# Altium schematic sheet Practica.SchDoc
size A4; SheetNumber: 1; SheetTotal: 1
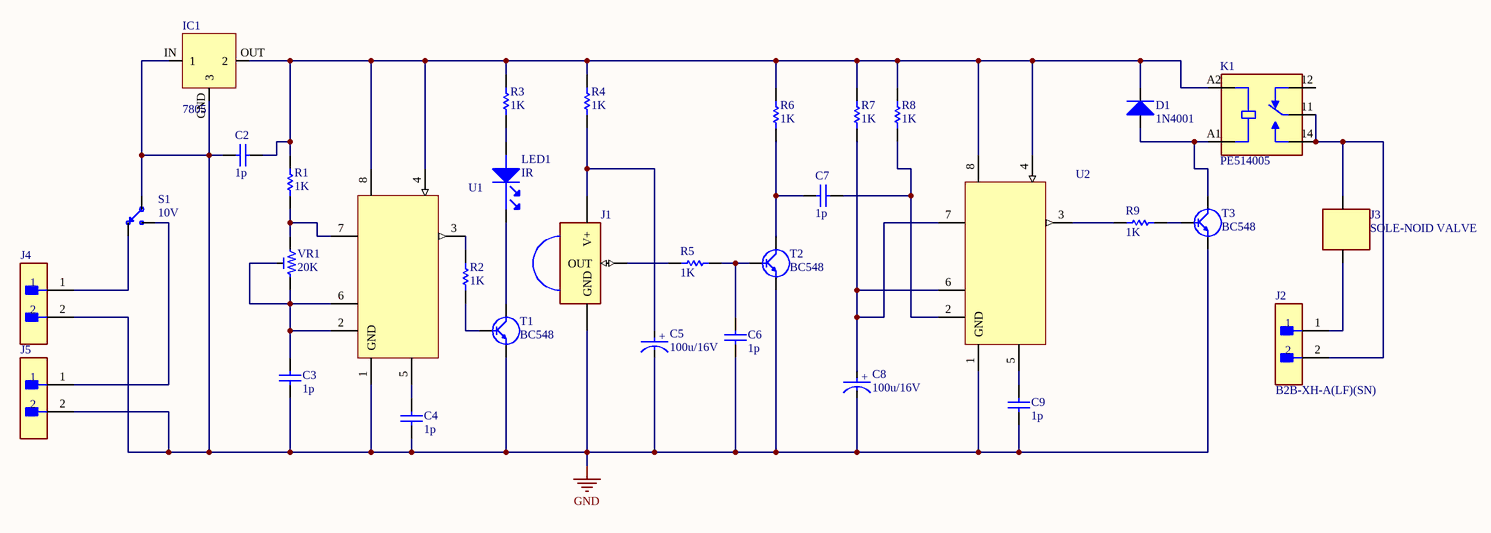
[diagram p0: Practica.SchDoc]

## Parts
C2  value 1p  [CAPC1005X55N]  (hidden comment: Capacitor)
C3  value 1p  [CAPC1005X55N]  (hidden comment: Capacitor)
C4  value 1p  [CAPC1005X55N]  (hidden comment: Capacitor)
C5  100u/16V  [WCAP-ASLI_D4H5.5]
C6  value 1p  [CAPC1005X55N]  (hidden comment: Capacitor)
C7  value 1p  [CAPC1005X55N]  (hidden comment: Capacitor)
C8  100u/16V  [WCAP-ASLI_D4H5.5]
C9  value 1p  [CAPC1005X55N]  (hidden comment: Capacitor)
D1  1N4001  [DIOAD1036W78L470D235]
IC1  7805  [78XXS]
J1  TSOP1738  [TSOP17XX]  (value not drawn)
J2  B2B-XH-A(LF)(SN)  [FP-B2B-XH-A_LF_SN-MFG]
J3  SOLE-NOID VALVE  [PHOENIX_1904147]
J4  B2B-XH-A(LF)(SN)  [FP-B2B-XH-A_LF_SN-MFG]  (value not drawn)
J5  B2B-XH-A(LF)(SN)  [FP-B2B-XH-A_LF_SN-MFG]  (value not drawn)
K1  PE514005  [RELAY_PE514005]
LED1  IR  [LED3MM]
R1  value 1K  [RESC1005X40N]  (hidden comment: Resistor)
R2  value 1K  [RESC1005X40N]  (hidden comment: Resistor)
R3  value 1K  [RESC1005X40N]  (hidden comment: Resistor)
R4  value 1K  [RESC1005X40N]  (hidden comment: Resistor)
R5  value 1K  [RESC1005X40N]  (hidden comment: Resistor)
R6  value 1K  [RESC1005X40N]  (hidden comment: Resistor)
R7  value 1K  [RESC1005X40N]  (hidden comment: Resistor)
R8  value 1K  [RESC1005X40N]  (hidden comment: Resistor)
R9  value 1K  [RESC1005X40N]  (hidden comment: Resistor)
S1  10V  [SW_A101SYZQ04]
T1  BC548  [TO92250P510H770-3]
T2  BC548  [TO92250P510H770-3]
T3  BC548  [TO92250P510H770-3]
U1  LMC555CMM/NOPB  [DGK0008A_L]  (value not drawn)
U2  LMC555CMM/NOPB  [DGK0008A_L]  (value not drawn)
VR1  20K  [TRIM_PV36W203C01B00]

## Nets
GND: C2.1 C3.1 C4.1 C5.1(C) C6.1 C8.1(C) C9.1 IC1.GND(3) IC1.IN(1) J1.GND J4.2 J5.2 S1.3 T1.3 T2.3 T3.3 U1.1(GND) U2.1(GND)
NetC2_2: C2.2 D1.C IC1.OUT(2) K1.A2(COIL1) R1.2 R3.2 R4.2 R6.2 R7.2 R8.2 U1.4(~{RST}) U1.8(V+) U2.4(~{RST}) U2.8(V+)
NetC3_2: C3.2 U1.2(~{TRIG}) U1.6(THR) VR1.2 VR1.3
NetC4_2: C4.2 U1.5(CVOLT)
NetC5_2: C5.2(A) J1.V+ R4.1
NetC6_2: C6.2 R5.1 T2.1
NetC7_1: C7.1 R6.1 T2.2
NetC7_2: C7.2 R8.1 U2.2(~{TRIG})
NetC8_2: C8.2(A) R7.1 U2.6(THR) U2.7(DIS)
NetC9_2: C9.2 U2.5(CVOLT)
NetD1_A: D1.A K1.A1(COIL2) T3.2
NetJ1_OUT: J1.OUT R5.2
NetJ2_1: J2.1 J3.2
NetJ2_2: J2.2 J3.1 K1.11(COM) K1.14(NO)
NetJ4_1: J4.1 S1.2
NetJ5_1: J5.1 S1.1
NetLED1_A: LED1.A R3.1
NetLED1_K: LED1.K T1.2
NetR1_1: R1.1 U1.7(DIS) VR1.1
NetR2_1: R2.1 T1.1
NetR2_2: R2.2 U1.3(OUT)
NetR9_1: R9.1 U2.3(OUT)
NetR9_2: R9.2 T3.1

Not connected (* = marked no-connect by the designer): K1 12(NC)

## Notes on the sheet
- (in symbol a00bbbee19879c290e62620ae7e47b1) +

## Library data of the parts
C2-C4 C6 C7 C9 = Capacitor: SimulationGenericComponent: True
C5 C8 = a00bbbee19879c290e62620ae7e47b1: 15uF 6.3V  ±20% 3.5Ω 1206  SMD Tantalum Capacitor; Manufacturer: Wurth Electronics; Manufacturer Part Number: 865080340001; ESR (Equivalent Series Resistance): 4R; Leakage Current: 900nA; Polarity: Polar; Dissipation Factor: 8%; Capacitor Type: Aluminium; Min Operating Temperature: -55°C; Weight: 0.000571oz; RoHS Compliant: Yes; Features: General Purpose; Length: 3.2mm; Max Operating Temperature: 125°C; Voltage Rating (DC): 6.3V; Width: 0.063inch; Lead Free: Lead Free; Termination: SMD/SMT; Height: 1.2mm; Depth: 1.6mm; Case/Package: 1206; Number of Pins: 2; Capacitance: 15uF; Case Code (Imperial): 1206; Series: TAJ; Tolerance: 20%; Voltage Rating: 6.3V; Dielectric Material: Tantalum; Construction: Flat; Case Code (Metric): 3216; Height - Seated (Max): 0.047inch; Packaging: Tape and Reel; Radiation Hardening: No; Mount: Surface Mount; Package Quantity: 2500; Supplier: Digikey; Supplier Part Number: 732-8411-1-ND; RoHS: Yes; Category: Aluminum Electrolytic Capacitors; Stock: 3909; Pricing: 1=0,18, 50=0,156, 100=0,135, 250=0,121, 500=0,105, 1000=0,1 (USD); Pins: 2; Reach SVHC Compliant: Yes; ComponentLink1URL: https://datasheet.ciiva.com:443/pdfs/VipMasterIC/IC/MIDC/MIDC-S-A0000770067/MIDC-S-A0000769932-1.pdf?src-supplier=IHS+Markit; ComponentLink1Description: https://datasheet.ciiva.com:443/pdfs/VipMasterIC/IC/MIDC/MIDC-S-A0000770067/MIDC-S-A0000769932-1.pdf?src-supplier=IHS+Markit; ComponentLink2URL: http://www.farnell.com/datasheets/1880118.pdf?src-supplier=Farnell; ComponentLink2Description: http://www.farnell.com/datasheets/1880118.pdf?src-supplier=Farnell; ComponentLink3URL: https://katalog.we-online.de/pbs/datasheet/865080340001.pdf?src-supplier=Digikey; ComponentLink3Description: https://katalog.we-online.de/pbs/datasheet/865080340001.pdf?src-supplier=Digikey; ComponentLink4URL: http://www.farnell.com/datasheets/1880118.pdf?src-supplier=Element14; ComponentLink4Description: http://www.farnell.com/datasheets/1880118.pdf?src-supplier=Element14; ComponentLink5URL: http://www.farnell.com/datasheets/1880118.pdf?src-supplier=Newark; ComponentLink5Description: http://www.farnell.com/datasheets/1880118.pdf?src-supplier=Newark
D1 = 1N4001: Manufacturer: Good-Ark; Supplier: DigiKey; Supplier Part Number: 4786-1N4001CT-ND; Manufacturer Part Number: 1N4001; RoHS: No; Stock: 12684; Pricing: 1=0,15, 10=0,09, 100=0,0557, 500=0,0403, 1000=0,03531, 2000=0,03109 (USD)
IC1 = IC1: Fixed Positive Standard Regulator, 5VBIPolar, PSSO2; Manufacturer: onsemi; Manufacturer Part Number: MC7805BDTG; Package Body Material: Plastic; Dropout Voltage1-Nom: 2V; Input Voltage Absolute-Max: 35V; Max Supply Voltage: 20V; Min Input Voltage: 7.5V; Channels: 1; Output Current1-Max: 1A; Output Voltage1-Max: 5.25V; Output Voltage1-Min: 4.75V; Output Voltage1-Nom: 5V; Package Equivalence Code: SMSIP3H,.38,90TB; Regulator Type: FIXED POSITIVE SINGLE OUTPUT STANDARD REGULATOR; Time @ Peak Reflow Temperature-Max (s): 40s; Voltage Tolerance-Max: 5%; Qualification Status: Not Qualified; Supplier: Future Electronics; Supplier Part Number: 9503160; RoHS: Yes; Category: Voltage Regulators - Linear; Stock: 3900; Pricing: 75=0,115, 750=0,111, 2250=0,109, 9375=0,106, 22500=0,103 (USD); Case/Package: TO-252; Pins: 2; Package Shape: Rectangular; Terminal Finish: Tin; JESD-609 Code: e3; Adjustability: FIXED; JESD-30 Code: R-PSSO-G2; Moisture Sensitivity Level: 1; Number of Outputs: 1; Operating Temperature, TJ-Max: 125°C; Operating Temperature, TJ-Min: -40°C; Packaging: Rail/Tube; Peak Reflow Temperature (Cel): 260°C; Surface Mount: Yes; Technology: BIPOLAR; Terminal Form: Gull Wing; Terminal Position: SINGLE; Length: 6.54mm; Width: 6.095mm; Height - Seated (Max): 2.51mm; Terminal Pitch: 2.29mm; RoHS Compliant: Yes; Reach SVHC Compliant: No; ComponentLink1URL: https://datasheet.ciiva.com:443/pdfs/VipMasterIC/IC/ONSM/ONSM-S-A0009067490/ONSM-S-A0009067422-1.pdf?src-supplier=IHS+Markit; ComponentLink1Description: https://datasheet.ciiva.com:443/pdfs/VipMasterIC/IC/ONSM/ONSM-S-A0009067490/ONSM-S-A0009067422-1.pdf?src-supplier=IHS+Markit; ComponentLink2URL: https://datasheet.ciiva.com/1512/1726421-1512154.pdf?src-supplier=Element14; ComponentLink2Description: https://datasheet.ciiva.com/1512/1726421-1512154.pdf?src-supplier=Element14; ComponentLink3URL: https://datasheet.ciiva.com/18428/70100553-18428182.pdf?src-supplier=Allied+Electronics; ComponentLink3Description: https://datasheet.ciiva.com/18428/70100553-18428182.pdf?src-supplier=Allied+Electronics
J1 = TSOP1738: IR Remote Receiver 38KHz 35m 3-Pin; MP: TSOP1738.; MF: Vishay; Check_prices: https://www.snapeda.com/parts/TSOP1738./Vishay/view-part/?ref=eda; Value: *; Availability: Not in stock; Price: None; Package: DIP-3 Vishay; SnapEDA_Link: https://www.snapeda.com/parts/TSOP1738./Vishay/view-part/?ref=snap
J2 J4 J5 = CON2: CONN HEADER VERT 2POS 2.5MM; Current Rating: 3A; Voltage Rating: 250V; Number of Contacts: 2; Contact Resistance: 20mR; Wire/Cable Gauge: 22AWG; Insulation Resistance: 1GR; Connector Type: Male Pin; Packaging: Bulk; Contact Material: Brass; Lead Free: Lead Free; Orientation: Straight; Contact Plating: Tin; Max Current Rating: 3A; Termination: Solder; Fastening Type: Detent; Depth: 5.75mm; Housing Material: Polyamide; REACH SVHC: No SVHC; Series: XH; Voltage Rating (AC): 250V; Number of Positions: 2; Color: Natural; Contact Type: Male Pin; Max Voltage Rating (DC): 250V; Pitch: 2.5mm; Lead Pitch: 2.5mm; Mount: Through Hole; Max Operating Temperature: 85°C; Length: 7.4mm; Max Voltage Rating (AC): 250V; Min Operating Temperature: -25°C; Number of Rows: 1; Housing Color: White
J3 = SOLE-NOID VALVE: PCB Terminal Screw 9.52mm 10AWG 1000V 32A 2 Position Combicon Power Series | Phoenix Contact 1904147; SnapEDA_Link: https://www.snapeda.com/parts/1904147/Phoenix+Contact/view-part/?ref=snap; Package: None; Value: *; MF: Phoenix Contact; MP: 1904147; Check_prices: https://www.snapeda.com/parts/1904147/Phoenix+Contact/view-part/?ref=eda
K1 = PE514005: Shrack, Relay,miniature,PCB,SPDT,5A,5Vdc coil, 1-1393219-7 | TE Connectivity PE514005; SnapEDA_Link: https://www.snapeda.com/parts/PE514005/TE+Connectivity/view-part/?ref=snap; Package: None; Value: *; MF: TE Connectivity; MP: PE514005; Check_prices: https://www.snapeda.com/parts/PE514005/TE+Connectivity/view-part/?ref=eda
LED1 = LED: LED SM 0603 3V -/1000/-MCD GREEN; Manufacturer: Visual Communications; Manufacturer Part Number: LSM0603453V; Optoelectronic Device Type: SINGLE COLOR LED; Supplier: Digikey; Supplier Part Number: LSM0603453VCT-ND; RoHS: Yes; Category: LEDs; Stock: 23373; Pricing: 1=0,5, 10=0,291, 100=0,1218, 500=0,1086, 1000=0,1071 (USD); Reach SVHC Compliant: Yes; RoHS Compliant: Yes; ComponentLink1URL: https://datasheet.ciiva.com:443/pdfs/VipMasterIC/IC/VISU/VISU-S-A0009188582/VISU-S-A0009188582-1.pdf?src-supplier=IHS+Markit; ComponentLink1Description: https://datasheet.ciiva.com:443/pdfs/VipMasterIC/IC/VISU/VISU-S-A0009188582/VISU-S-A0009188582-1.pdf?src-supplier=IHS+Markit; ComponentLink2URL: http://www.farnell.com/datasheets/2699708.pdf?src-supplier=Farnell; ComponentLink2Description: http://www.farnell.com/datasheets/2699708.pdf?src-supplier=Farnell; ComponentLink3URL: http://www.farnell.com/datasheets/2699708.pdf?src-supplier=Newark; ComponentLink3Description: http://www.farnell.com/datasheets/2699708.pdf?src-supplier=Newark; ComponentLink4URL: https://vcclite.com/wp-content/uploads/wpallimport/files/files/LSM0603453V.pdf?src-supplier=Digikey; ComponentLink4Description: https://vcclite.com/wp-content/uploads/wpallimport/files/files/LSM0603453V.pdf?src-supplier=Digikey
R1-R9 = Resistor: TC1: 0; SimulationGenericComponent: True; TC2: 0
S1 = switch: Toggle Switch; Manufacturer: E-Switch; Manufacturer Part Number: 100SP2T1B1M1QEH; Supplier: Digikey; Supplier Part Number: EG2373-ND; RoHS: Yes; Category: Toggle Switches; Stock: 704; Pricing: 1=3,17, 10=2,739, 25=2,5836, 96=2,37021, 192=2,26708, 288=2,20875, 576=2,11234, 1056=2,03137 (USD); Terminal Finish: Silver; JESD-609 Code: e4; Manufacturer Series: 100SP2T1B1M1QEH; Switch Type: Toggle; Reach SVHC Compliant: Yes; RoHS Compliant: Yes; ComponentLink1URL: https://datasheet.ciiva.com:443/pdfs/VipMasterIC/IC/ESCH/ESCH-S-A0000009934/ESCH-S-A0000009793-1.pdf?src-supplier=IHS+Markit; ComponentLink1Description: https://datasheet.ciiva.com:443/pdfs/VipMasterIC/IC/ESCH/ESCH-S-A0000009934/ESCH-S-A0000009793-1.pdf?src-supplier=IHS+Markit; ComponentLink2URL: https://datasheet.ciiva.com/2909/1012640000-jpg-2909139.pdf?src-supplier=Digikey; ComponentLink2Description: https://datasheet.ciiva.com/2909/1012640000-jpg-2909139.pdf?src-supplier=Digikey; ComponentLink3URL: https://datasheet.ciiva.com/16323/100-16323293.pdf?src-supplier=Future+Electronics; ComponentLink3Description: https://datasheet.ciiva.com/16323/100-16323293.pdf?src-supplier=Future+Electronics
T1-T3 = BC548: Bipolar (BJT) Transistor NPN 30 V 100 mA 300MHz 500 mW Through Hole TO-92-3; Manufacturer: onsemi; Package Body Material: Plastic; Transistor Element Material: SILICON; Max Collector Current: 100mA; Collector-emitter Voltage-Max: 30V; DC Current Gain-Min (hFE): 110; Number of Elements: 1; Power Dissipation-Max (Abs): 625mW; Surface Mount: No; Transistor Application: AMPLIFIER; JEDEC-95 Code: TO-92; Qualification Status: Not Qualified; Supplier: Avnet; Supplier Part Number: BC548; Manufacturer Part Number: BC548; RoHS: No; Pins: 3; Package Shape: Round; Max Operating Temperature: 150°C; Polarity/Channel Type: NPN; JESD-30 Code: O-PBCY-T3; Package Style: CYLINDRICALMeter; Terminal Form: Through Hole; Terminal Position: BOTTOM; Frequency: 300MHz; ComponentLink1URL: https://datasheet.ciiva.com:443/pdfs/VipMasterIC/IC/ONSM/ONSMS29139/ONSMS26476-1.pdf?src-supplier=IHS+Markit; ComponentLink1Description: https://datasheet.ciiva.com:443/pdfs/VipMasterIC/IC/ONSM/ONSMS29139/ONSMS26476-1.pdf?src-supplier=IHS+Markit; ComponentLink2URL: https://datasheet.ciiva.com/17179/bc548-17179734.pdf?src-supplier=Future+Electronics; ComponentLink2Description: https://datasheet.ciiva.com/17179/bc548-17179734.pdf?src-supplier=Future+Electronics; ComponentLink3URL: https://datasheet.ciiva.com/982/bc546-982816.pdf?src-supplier=Digikey; ComponentLink3Description: https://datasheet.ciiva.com/982/bc546-982816.pdf?src-supplier=Digikey; ComponentLink4URL: https://datasheet.ciiva.com/7972/1868820-7972717.pdf?src-supplier=Element14; ComponentLink4Description: https://datasheet.ciiva.com/7972/1868820-7972717.pdf?src-supplier=Element14; ComponentLink5URL: https://datasheet.ciiva.com/15208/getdatasheetpartid-171976-15208731.pdf?src-supplier=Verical; ComponentLink5Description: https://datasheet.ciiva.com/15208/getdatasheetpartid-171976-15208731.pdf?src-supplier=Verical
U1 U2 = LM555: CMOS Timer, 8-pin Mini SOIC, Pb-Free; Manufacturer: Texas Instruments; PowerWise: N; CompType: Analog IC; PackageTopMarking: ZXTT*ZC5; PackageDescription: MINI SOIC, .118 x .118 x .034in, 8 Lead, .0256in Pitch; PackageReference: DGK0008A; ComponentLink1Description: Datasheet URL; ComponentLink1URL: http://www.ti.com/general/docs/lit/getliterature.tsp?genericPartNumber=LMC555&fileType=pdf; RoHS: Y; PinCount: 8; Code_JEDEC: MO-187-AA
VR1 = VR: 20 kOhms 0.5W, 1/2W PC Pins Through Hole Trimmer Potentiometer Cermet 25.0 Turn Top Adjustment; Manufacturer: Bourns; Manufacturer Part Number: PV36W203C01B00; Supplier: Digikey; Supplier Part Number: 118-PV36W203C01B00-ND; RoHS: Yes; Category: LDO; Stock: 3799; Pricing: 1=1,53, 10=1,291, 100=1,0844, 500=0,95864, 1000=0,90877, 5000=0,80229, 10000=0,76023 (USD); Resistor Type: TRIMMER; RoHS Compliant: Yes; Reach SVHC Compliant: No; ComponentLink1URL: https://datasheet.ciiva.com:443/pdfs/VipMasterIC/IC/BOUR/BOUR-S-A0003720351/BOUR-S-A0003720351-1.pdf?src-supplier=IHS+Markit; ComponentLink1Description: https://datasheet.ciiva.com:443/pdfs/VipMasterIC/IC/BOUR/BOUR-S-A0003720351/BOUR-S-A0003720351-1.pdf?src-supplier=IHS+Markit; ComponentLink2URL: http://www.mouser.com/ds/2/54/v36-907345.pdf?src-supplier=Mouser; ComponentLink2Description: http://www.mouser.com/ds/2/54/v36-907345.pdf?src-supplier=Mouser; ComponentLink3URL: https://www.bourns.com/docs/Product-Datasheets/pv36.pdf?src-supplier=Digikey; ComponentLink3Description: https://www.bourns.com/docs/Product-Datasheets/pv36.pdf?src-supplier=Digikey; ComponentLink4URL: https://datasheet.octopart.com/PV36W203C01B00-Bourns-datasheet-154729827.pdf?src-supplier=Electro+Sonic; ComponentLink4Description: https://datasheet.octopart.com/PV36W203C01B00-Bourns-datasheet-154729827.pdf?src-supplier=Electro+Sonic